# Altium schematic sheet SPI_SD.SchDoc
size A4
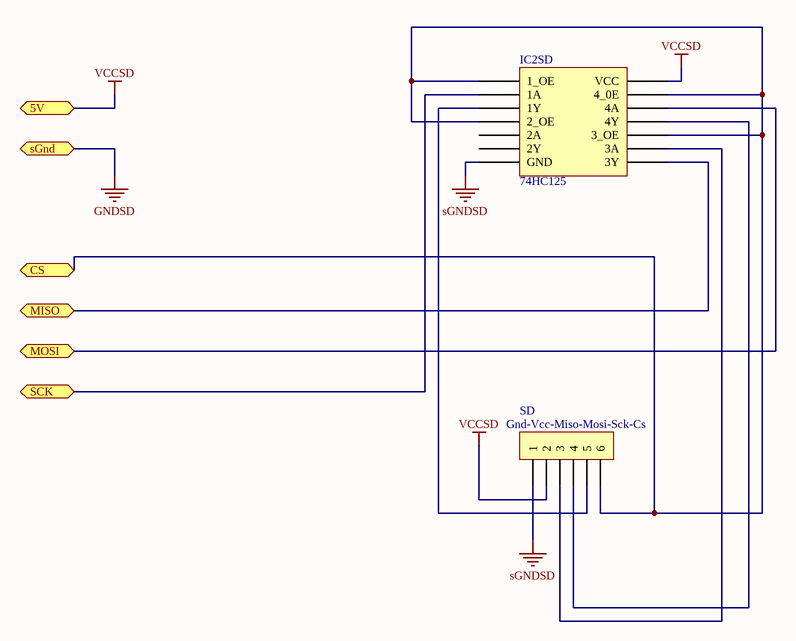
[diagram p0: SPI_SD.SchDoc]

## Parts
IC2SD  74HC125  [DIP14B]
SD  Gnd-Vcc-Miso-Mosi-Sck-Cs  [CON6]

## Ports
5V, CS, MISO, MOSI, SCK, sGnd

## Nets
GNDSD: port sGnd
sGNDSD: IC2SD.7(GND) SD.1
VCCSD: IC2SD.14(VCC) SD.2 ; port 5V
CS: IC2SD.1(1_OE) IC2SD.4(2_OE) IC2SD.10(3_OE) IC2SD.13(4_0E) SD.6 ; port CS
MISO: IC2SD.8(3Y) ; port MISO
MOSI: IC2SD.12(4A) ; port MOSI
SCK: IC2SD.2(1A) ; port SCK
NetIC2SD_3: IC2SD.3(1Y) SD.5
NetIC2SD_9: IC2SD.9(3A) SD.3
NetIC2SD_11: IC2SD.11(4Y) SD.4

Not connected (* = marked no-connect by the designer): IC2SD 5(2A) 6(2Y)

## Library data of the parts
SD = CON6: Conector 6